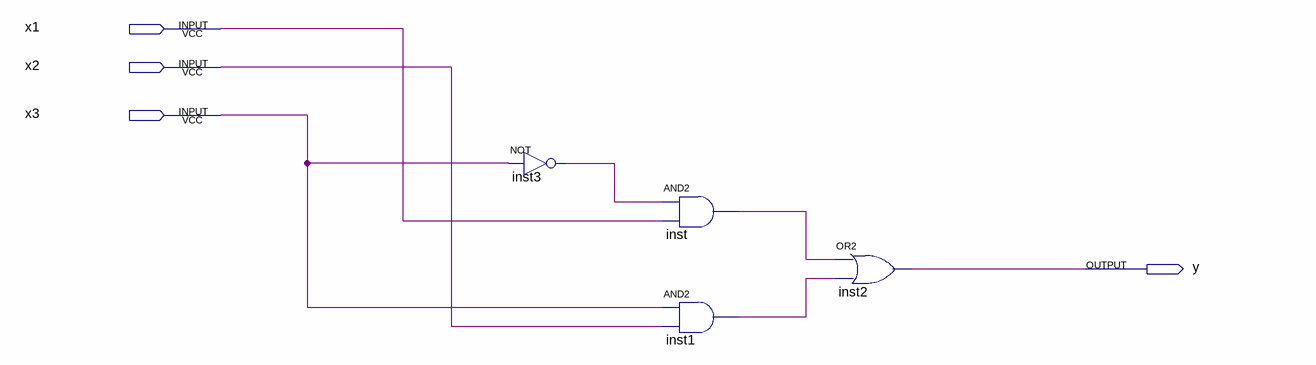
[diagram p0: schematic sheet]
// Quartus schematic laba2.bdf as structural Verilog: 4 symbols, 4 pins
module laba2 (
  input  x1,
  input  x2,
  input  x3,
  output y
);

  wire inst1_out, inst3_out, inst_out;

  not inst3 (inst3_out, x3);
  and inst (inst_out, inst3_out, x1);
  and inst1 (inst1_out, x3, x2);
  or inst2 (y, inst_out, inst1_out);
endmodule
